# EAGLE schematic Sunrise_Alarm_Clock (EAGLE 9.6.2)
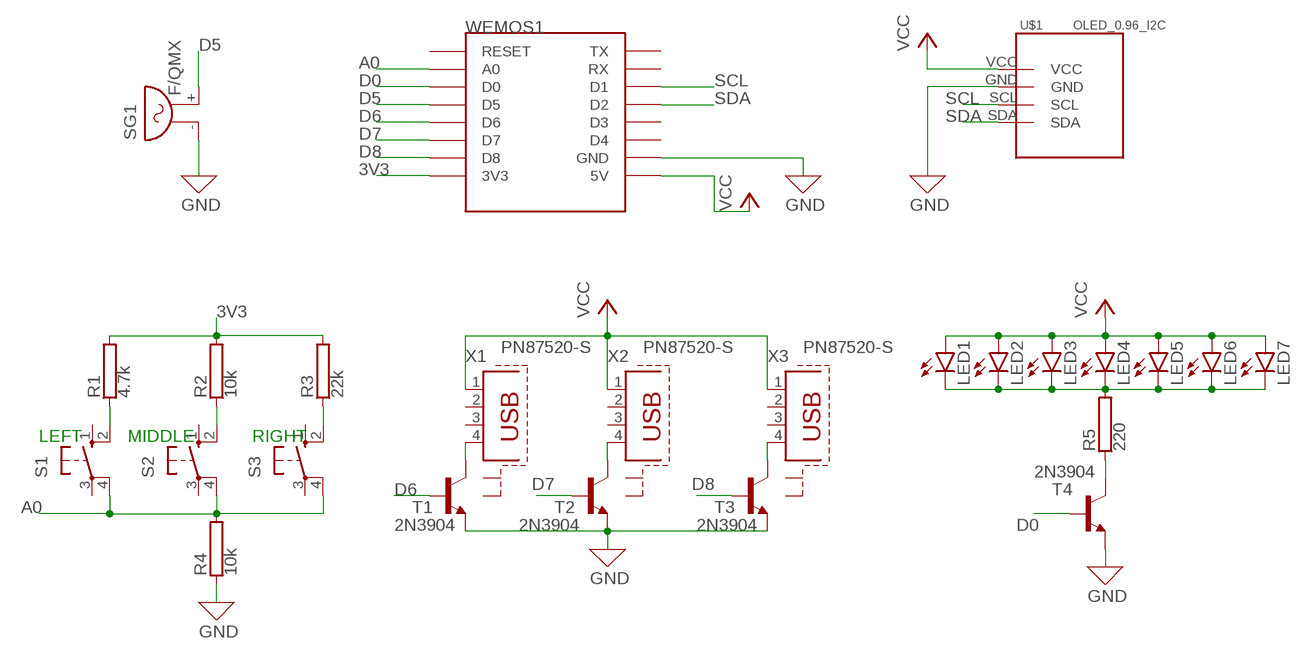
[diagram p0: schematic, sheet 1]

## Parts
LED1  LED5MM  [LED5MM]
LED2  LED5MM  [LED5MM]
LED3  LED5MM  [LED5MM]
LED4  LED5MM  [LED5MM]
LED5  LED5MM  [LED5MM]
LED6  LED5MM  [LED5MM]
LED7  LED5MM  [LED5MM]
R1  4.7k  RAC01  [AC01]
R2  10k  RAC01  [AC01]
R3  22k  RAC01  [AC01]
R4  10k  RAC01  [AC01]
R5  220  RAC01  [AC01]
S1  10-XX  [B3F-10XX]
S2  10-XX  [B3F-10XX]
S3  10-XX  [B3F-10XX]
SG1  F/QMX  [F/QMX]
T1  2N3904  [TO92]
T2  2N3904  [TO92]
T3  2N3904  [TO92]
T4  2N3904  [TO92]
U$1  OLED_0.96_I2C  [OLED_0.96_I2C]
WEMOS1  WEMOS-D1-MINI  [WEMOS-D1-MINI]
X1  PN87520-S  [PN87520-S]
X2  PN87520-S  [PN87520-S]
X3  PN87520-S  [PN87520-S]

## Nets
3V3: R1.2 R2.2 R3.2 WEMOS1.3V3
A0: R4.2 S1.4(P1) S2.4(P1) S3.4(P1) WEMOS1.A0
D0: T4.2(B) WEMOS1.D0
D5: SG1.+ WEMOS1.D5
D6: T1.2(B) WEMOS1.D6
D7: T2.2(B) WEMOS1.D7
D8: T3.2(B) WEMOS1.D8
GND: R4.1 SG1.- T1.3(E) T2.3(E) T3.3(E) T4.3(E) U$1.GND WEMOS1.GND
N$1: T3.1(C) X3.4
N$5: T2.1(C) X2.4
N$6: T1.1(C) X1.4
N$8: R3.1 S3.2(S1)
N$9: R2.1 S2.2(S1)
N$11: R1.1 S1.2(S1)
N$14: R5.1 T4.1(C)
N$18: LED1.K(C) LED2.K(C) LED3.K(C) LED4.K(C) LED5.K(C) LED6.K(C) LED7.K(C) R5.2
SCL: U$1.SCL WEMOS1.D1
SDA: U$1.SDA WEMOS1.D2
VCC: LED1.A LED2.A LED3.A LED4.A LED5.A LED6.A LED7.A U$1.VCC WEMOS1.5V X1.1 X2.1 X3.1
Unconnected: S1.1(S) S1.3(P) S2.1(S) S2.3(P) S3.1(S) S3.3(P) WEMOS1.D3 WEMOS1.D4 WEMOS1.RESET WEMOS1.RX WEMOS1.TX X1.2 X1.3 X1.S1 X1.S2 X2.2 X2.3 X2.S1 X2.S2 X3.2 X3.3 X3.S1 X3.S2

## Notes on the sheet
- LEFT | MIDDLE | RIGHT

## Library data of the parts
LED1-LED7 = led:LED: LED OSRAM: - CHIPLED LG R971, LG N971, LY N971, LG Q971, LY Q971, LO R971, LY R971 LH N974, LH R974 LS Q976, LO Q976, LY Q976 LO Q996 - Hyper CHIPLED LW Q18S LB Q993, LB Q99A, LB R99A - SideLED LS A670, LO A670, LY A670, LG A670, LP A670 LB A673, LV A673, LT A673, LW A673 LH A674 LY A675 LS A676, LA A676, LO A676, LY A676, LW A676 LS A679, LY A679, LG A679 - Hyper Micro SIDELED® LS Y876, LA Y876, LO Y876, LY Y876 LT Y87S - SmartLED LW L88C, LW L88S LB L89C, LB L89S, LG L890 LS L89K, LO L89K, LY L89K LS L896, LA L896, LO L896, LY L896 - TOPLED LS T670, LO T670, LY T670, LG T670, LP T670 LSG T670, LSP T670, LSY T670, LOP T670, LYG T670 LG T671, LOG T671, LSG T671 LB T673, LV T673, LT T673, LW T673 LH T674 LS T676, LA T676, LO T676, LY T676, LB T676, LH T676, LSB T676, LW T676 LB T67C, LV T67C, LT T67C, LS T67K, LO T67K, LY T67K, LW E67C LS E67B, LA E67B, LO E67B, LY E67B, LB E67C, LV E67C, LT E67C LW T67C LS T679, LY T679, LG T679 LS T770, LO T770, LY T770, LG T770, LP T770 LB T773, LV T773, LT T773, LW T773 LH T774 LS E675, LA E675, LY E675, LS T675 LS T776, LA T776, LO T776, LY T776, LB T776 LHGB T686 LT T68C, LB T68C - Hyper Mini TOPLED® LB M676 - Mini TOPLED Santana® LG M470 LS M47K, LO M47K, LY M47K Source: http://www.osram.convergy.de LUXEON: - LUMILED® LXK2-PW12-R00, LXK2-PW12-S00, LXK2-PW14-U00, LXK2-PW14-V00 LXK2-PM12-R00, LXK2-PM12-S00, LXK2-PM14-U00 LXK2-PE12-Q00, LXK2-PE12-R00, LXK2-PE12-S00, LXK2-PE14-T00, LXK2-PE14-U00 LXK2-PB12-K00, LXK2-PB12-L00, LXK2-PB12-M00, LXK2-PB14-N00, LXK2-PB14-P00, LXK2-PB14-Q00 LXK2-PR12-L00, LXK2-PR12-M00, LXK2-PR14-Q00, LXK2-PR14-R00 LXK2-PD12-Q00, LXK2-PD12-R00, LXK2-PD12-S00 LXK2-PH12-R00, LXK2-PH12-S00 LXK2-PL12-P00, LXK2-PL12-Q00, LXK2-PL12-R00 Source: www.luxeon.com KINGBRIGHT: KA-3528ASYC Source: www.kingbright.com
R1-R5 = resistor-power:R: Power Resitor; OC_FARNELL: unknown; OC_NEWARK: unknown
S1-S3 = switch-omron:10-XX: OMRON SWITCH; MPN: B3F-1000; OC_FARNELL: 176432; OC_NEWARK: 36M3542
SG1 = buzzer:F/QMX: BUZZER Source: Buerklin; OC_FARNELL: unknown; OC_NEWARK: unknown
T1-T4 = transistor:2N3904: NPN TRANSISTOR
U$1 = tft_1_8_1_44_oled_0_96:OLED_0.96_I2C
WEMOS1 = esp8266modules:WEMOS-D1-MINI: WeMos.cc D1 mini ESP8266 module
X1-X3 = con-berg:PN87520-S; OC_FARNELL: unknown; OC_NEWARK: unknown